# Altium project HIVE_BOARD.PrjPcb (part 6 of 6)

## Sheet HIVE_BOARD_DEBUG.SchDoc
size Tabloid; SheetNumber: 10; SheetTotal: 12; Size: 11x17; Sheet_Name: DEBUG
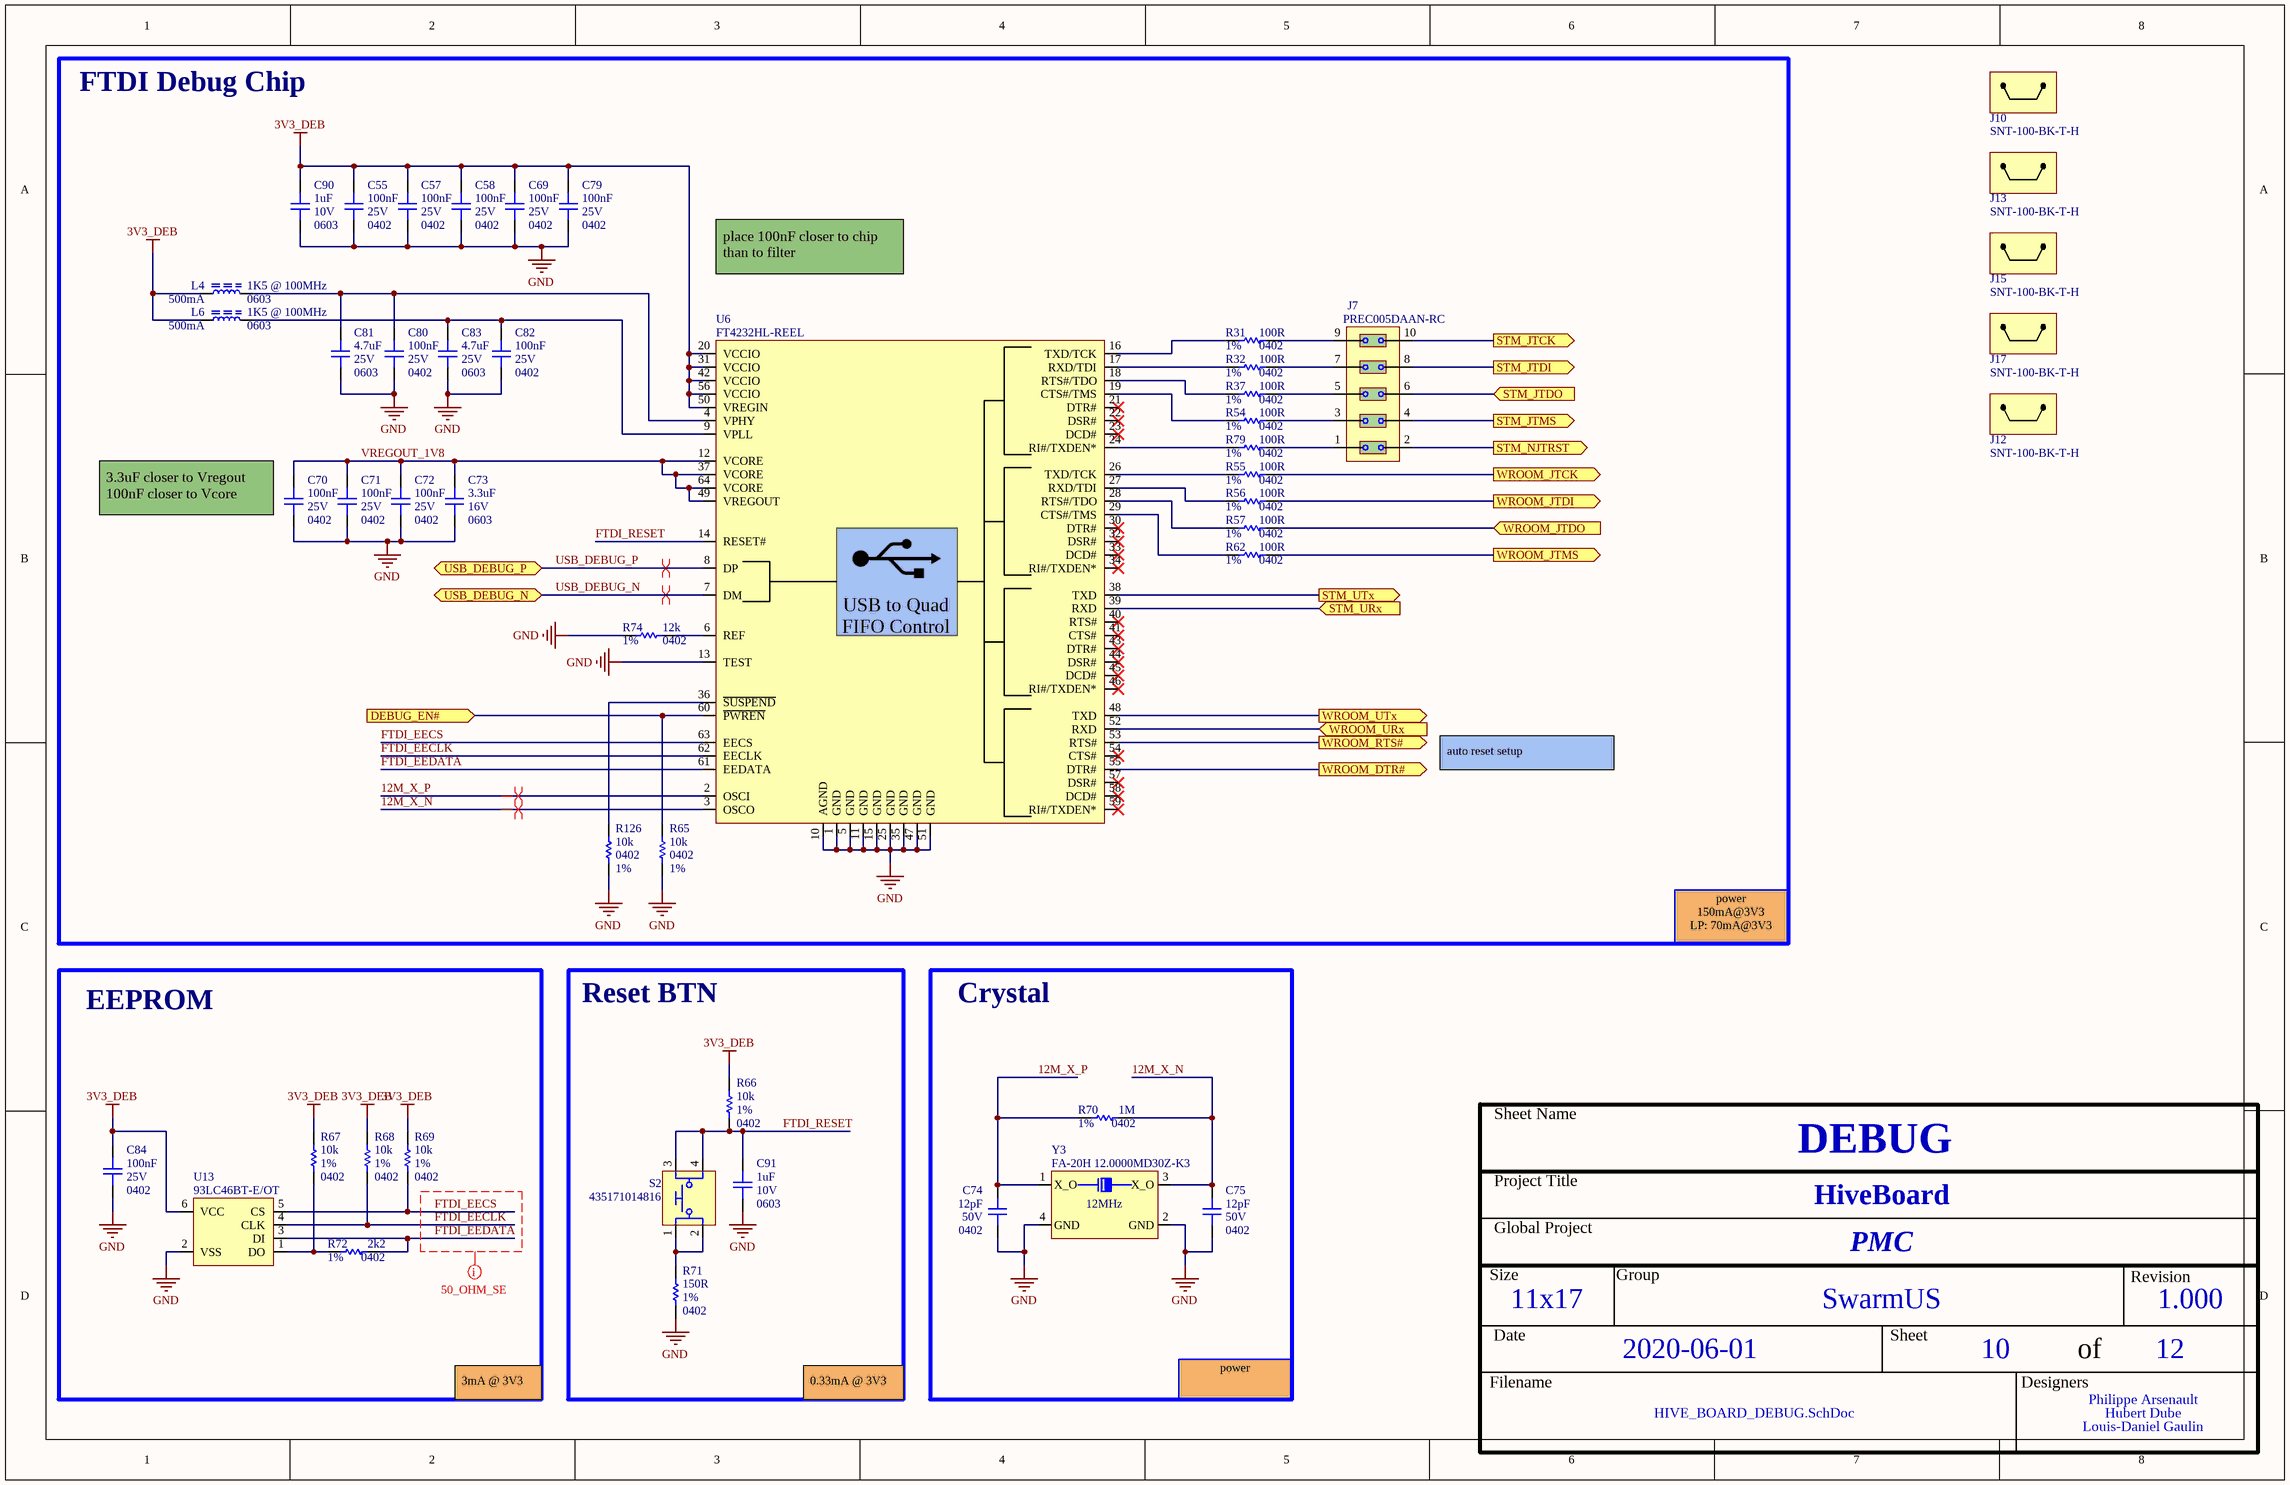
[diagram p11: HIVE_BOARD_DEBUG.SchDoc]

### Parts
C55  value 100nF  Package: 0402  Voltage Rating: 25V  [CAP_CER_0402]  (hidden comment: CGA2B3X7R1E104K050BB)
C57  value 100nF  Package: 0402  Voltage Rating: 25V  [CAP_CER_0402]  (hidden comment: CGA2B3X7R1E104K050BB)
C58  value 100nF  Package: 0402  Voltage Rating: 25V  [CAP_CER_0402]  (hidden comment: CGA2B3X7R1E104K050BB)
C69  value 100nF  Package: 0402  Voltage Rating: 25V  [CAP_CER_0402]  (hidden comment: CGA2B3X7R1E104K050BB)
C70  value 100nF  Package: 0402  Voltage Rating: 25V  [CAP_CER_0402]  (hidden comment: CGA2B3X7R1E104K050BB)
C71  value 100nF  Package: 0402  Voltage Rating: 25V  [CAP_CER_0402]  (hidden comment: CGA2B3X7R1E104K050BB)
C72  value 100nF  Package: 0402  Voltage Rating: 25V  [CAP_CER_0402]  (hidden comment: CGA2B3X7R1E104K050BB)
C73  value 3.3uF  Package: 0603  Voltage Rating: 16V  [CAP_CER_0603]  (hidden comment: C1608X5R1C335K080AC)
C74  value 12pF  Package: 0402  Voltage Rating: 50V  [CAP_CER_0402]  (hidden comment: CC0402JRNPO9BN120)
C75  value 12pF  Package: 0402  Voltage Rating: 50V  [CAP_CER_0402]  (hidden comment: CC0402JRNPO9BN120)
C79  value 100nF  Package: 0402  Voltage Rating: 25V  [CAP_CER_0402]  (hidden comment: CGA2B3X7R1E104K050BB)
C80  value 100nF  Package: 0402  Voltage Rating: 25V  [CAP_CER_0402]  (hidden comment: CGA2B3X7R1E104K050BB)
C81  value 4.7uF  Package: 0603  Voltage Rating: 25V  [CAP_CER_0603]  (hidden comment: CL10A475MA8NQNC)
C82  value 100nF  Package: 0402  Voltage Rating: 25V  [CAP_CER_0402]  (hidden comment: CGA2B3X7R1E104K050BB)
C83  value 4.7uF  Package: 0603  Voltage Rating: 25V  [CAP_CER_0603]  (hidden comment: CL10A475MA8NQNC)
C84  value 100nF  Package: 0402  Voltage Rating: 25V  [CAP_CER_0402]  (hidden comment: CGA2B3X7R1E104K050BB)
C90  value 1uF  Package: 0603  Voltage Rating: 10V  [CAP_CER_0603]  (hidden comment: C0603C105K8PACTU)
C91  value 1uF  Package: 0603  Voltage Rating: 10V  [CAP_CER_0603]  (hidden comment: C0603C105K8PACTU)
J7  PREC005DAAN-RC  [CON_HDR_PREC009DAAN-RC]
J10  SNT-100-BK-T-H  [CON_JMP_SNT-100-BK-T-H]
J12  SNT-100-BK-T-H  [CON_JMP_SNT-100-BK-T-H]
J13  SNT-100-BK-T-H  [CON_JMP_SNT-100-BK-T-H]
J15  SNT-100-BK-T-H  [CON_JMP_SNT-100-BK-T-H]
J17  SNT-100-BK-T-H  [CON_JMP_SNT-100-BK-T-H]
L4  value 1K5 @ 100MHz  Current Rating: 500mA  Package: 0603  [FER_0603]  (hidden comment: BLM18HE152SN1D)
L6  value 1K5 @ 100MHz  Current Rating: 500mA  Package: 0603  [FER_0603]  (hidden comment: BLM18HE152SN1D)
R31  value 100R  Tolerance: 1%  Package: 0402  [RES_0402]  (hidden comment: RC0402FR-07100RP)
R32  value 100R  Tolerance: 1%  Package: 0402  [RES_0402]  (hidden comment: RC0402FR-07100RP)
R37  value 100R  Tolerance: 1%  Package: 0402  [RES_0402]  (hidden comment: RC0402FR-07100RP)
R54  value 100R  Tolerance: 1%  Package: 0402  [RES_0402]  (hidden comment: RC0402FR-07100RP)
R55  value 100R  Tolerance: 1%  Package: 0402  [RES_0402]  (hidden comment: RC0402FR-07100RP)
R56  value 100R  Tolerance: 1%  Package: 0402  [RES_0402]  (hidden comment: RC0402FR-07100RP)
R57  value 100R  Tolerance: 1%  Package: 0402  [RES_0402]  (hidden comment: RC0402FR-07100RP)
R62  value 100R  Tolerance: 1%  Package: 0402  [RES_0402]  (hidden comment: RC0402FR-07100RP)
R65  value 10k  Tolerance: 1%  Package: 0402  [RES_0402]  (hidden comment: RC0402FR-0710KL)
R66  value 10k  Tolerance: 1%  Package: 0402  [RES_0402]  (hidden comment: RC0402FR-0710KL)
R67  value 10k  Tolerance: 1%  Package: 0402  [RES_0402]  (hidden comment: RC0402FR-0710KL)
R68  value 10k  Tolerance: 1%  Package: 0402  [RES_0402]  (hidden comment: RC0402FR-0710KL)
R69  value 10k  Tolerance: 1%  Package: 0402  [RES_0402]  (hidden comment: RC0402FR-0710KL)
R70  value 1M  Tolerance: 1%  Package: 0402  [RES_0402]  (hidden comment: RC0402FR-071ML)
R71  value 150R  Tolerance: 1%  Package: 0402  [RES_0402]  (hidden comment: RC0402FR-07150RL)
R72  value 2k2  Tolerance: 1%  Package: 0402  [RES_0402]  (hidden comment: RC0402FR-072K2L)
R74  value 12k  Tolerance: 1%  Package: 0402  [RES_0402]  (hidden comment: RC0402FR-0712KL)
R79  value 100R  Tolerance: 1%  Package: 0402  [RES_0402]  (hidden comment: RC0402FR-07100RP)
R126  value 10k  Tolerance: 1%  Package: 0402  [RES_0402]  (hidden comment: RC0402FR-0710KL)
S2  435171014816  [SWI_TACT_435171014816]
U6  FT4232HL-REEL  [COM_USB_FT4232HL-REEL]
U13  93LC46BT-E/OT  [MEM_EEPROM_93LC46BT-E/OT]
Y3  FA-20H 12.0000MD30Z-K3  [CRY_FA-20H]

### Blocks framed on the sheet
FTDI Debug Chip: C55 C57 C58 C69-C73 C79-C83 C90 J7 L4 L6 R31 R32 R37 R54-R57 R62 R65 R74 R79 R126 U6
EEPROM: C84 R67-R69 R72 U13
Reset BTN: C91 R66 R71 S2
Crystal: C74 C75 R70 Y3

### Ports
DEBUG_EN# (in), STM_JTCK (out), STM_JTDI (out), STM_JTDO (in), STM_JTMS (out), STM_NJTRST (out), STM_URx (in), STM_UTx (out), USB_DEBUG_N (bidir), USB_DEBUG_P (bidir), WROOM_DTR# (out), WROOM_JTCK (out), WROOM_JTDI (out), WROOM_JTDO (in), WROOM_JTMS (out), WROOM_RTS# (out), WROOM_URx (in), WROOM_UTx (out)

### Nets
3V3_DEB: C55.1 C57.1 C58.1 C69.1 C79.1 C84.1 C90.1 L4.1 L6.1 R66.2 R67.2 R68.2 R69.2 U6.20(VCCIO) U6.31(VCCIO) U6.42(VCCIO) U6.50(VREGIN) U6.56(VCCIO) U13.6(VCC)
GND: C55.2 C57.2 C58.2 C69.2 C70.2 C71.2 C72.2 C73.1 C74.1 C75.1 C79.2 C80.2 C81.1 C82.2 C83.1 C84.2 C90.2 C91.2 R65.2 R71.1 R74.1 R126.2 U6.1(GND) U6.5(GND) U6.10(AGND) U6.11(GND) U6.13(TEST) U6.15(GND) U6.25(GND) U6.35(GND) U6.47(GND) U6.51(GND) U13.2(VSS) Y3.2(GND) Y3.4(GND)
12M_X_N: C75.2 R70.1 U6.3(OSCO) Y3.3(X_O)
12M_X_P: C74.2 R70.2 U6.2(OSCI) Y3.1(X_O)
FTDI_EECLK: R68.1 U6.62(EECLK) U13.4(CLK)
FTDI_EECS: R69.1 U6.63(EECS) U13.5(CS)
FTDI_EEDATA: R72.1 U6.61(EEDATA) U13.3(DI)
FTDI_RESET: C91.1 R66.1 S2.3 S2.4 U6.14(RESET#)
USB_DEBUG_N: U6.7(DM) ; port USB_DEBUG_N
USB_DEBUG_P: U6.8(DP) ; port USB_DEBUG_P
VREGOUT_1V8: C70.1 C71.1 C72.1 C73.2 U6.12(VCORE) U6.37(VCORE) U6.49(VREGOUT) U6.64(VCORE)
NetC80_1: C80.1 C81.2 L4.2 U6.4(VPHY)
NetC82_1: C82.1 C83.2 L6.2 U6.9(VPLL)
NetJ7_1: J7.1 R79.1
NetJ7_2: J7.2 ; port STM_NJTRST
NetJ7_3: J7.3 R54.1
NetJ7_4: J7.4 ; port STM_JTMS
NetJ7_5: J7.5 R37.1
NetJ7_6: J7.6 ; port STM_JTDO
NetJ7_7: J7.7 R32.1
NetJ7_8: J7.8 ; port STM_JTDI
NetJ7_9: J7.9 R31.1
NetJ7_10: J7.10 ; port STM_JTCK
NetQ5_1: U6.55(DTR#) ; port WROOM_DTR#
NetQ5_2: U6.53(RTS#) ; port WROOM_RTS#
NetR31_2: R31.2 U6.16(TXD/TCK)
NetR32_2: R32.2 U6.17(RXD/TDI)
NetR37_2: R37.2 U6.18(RTS#/TDO)
NetR54_2: R54.2 U6.19(CTS#/TMS)
NetR55_1: R55.1 ; port WROOM_JTCK
NetR55_2: R55.2 U6.26(TXD/TCK)
NetR56_1: R56.1 ; port WROOM_JTDI
NetR56_2: R56.2 U6.27(RXD/TDI)
NetR57_1: R57.1 ; port WROOM_JTDO
NetR57_2: R57.2 U6.28(RTS#/TDO)
NetR62_1: R62.1 ; port WROOM_JTMS
NetR62_2: R62.2 U6.29(CTS#/TMS)
NetR65_1: R65.1 U6.60(~{PWREN}) ; port DEBUG_EN#
NetR67_1: R67.1 R72.2 U13.1(DO)
NetR71_2: R71.2 S2.1 S2.2
NetR74_2: R74.2 U6.6(REF)
NetR79_2: R79.2 U6.24(RI#/TXDEN*)
NetR126_1: R126.1 U6.36(~{SUSPEND})
NetU1_76: U6.39(RXD) ; port STM_URx
NetU1_77: U6.38(TXD) ; port STM_UTx
NetU5_34: U6.48(TXD) ; port WROOM_UTx
NetU5_35: U6.52(RXD) ; port WROOM_URx

Not connected (* = marked no-connect by the designer): U6 21(DTR#)* 22(DSR#)* 23(DCD#)* 30(DTR#)* 32(DSR#)* 33(DCD#)* 34(RI#/TXDEN*)* 40(RTS#)* 41(CTS#)* 43(DTR#)* 44(DSR#)* 45(DCD#)* 46(RI#/TXDEN*)* 54(CTS#)* 57(DSR#)* 58(DCD#)* 59(RI#/TXDEN*)*

### Layout directives
differential pair; net class DIFF_90: USB_DEBUG_N, USB_DEBUG_P
net class SE_50: FTDI_EECLK, FTDI_EECS, FTDI_EEDATA
differential pair; differential pair class DIFF_100: 12M_X_N, 12M_X_P

### Notes on the sheet
- place 100nF closer to chip than to filter
- (near C70) 3.3uF closer to Vregout
  100nF closer to Vcore
- auto reset setup
- power
  150mA@3V3
  LP: 70mA@3V3
- 3mA @ 3V3
- 0.33mA @ 3V3
- power
- Sheet Name
- Project Title
- Global Project
- Size
- Group
- Revision
- Date
- Sheet
- of
- Filename
- Designers
- (in symbol COM_USB_FT4232HL-REEL) / USB to Quad / FIFO Control

### Library data of the parts
C55 C57 C58 C69-C72 C79 C80 C82 C84 = CAP_CER_CGA2B3X7R1E104K050BB: CAP - CER 0.1µF 10% 25V X7R - 0402; Manufacturer #1: TDK Corporation; GRAMS Lib Spec: 2.8; Magnetic Material: Unknown; Polarized: NO; Assembly Type: SMD; CreatedBy/Date: Nicolas Roy 2018-11-07; Current Rating: *; HelpURL: https://product.tdk.com/info/en/catalog/datasheets/mlcc_automotive_general_en.pdf; Manufacturer #2: *; Note: *; Part Number #1: CGA2B3X7R1E104K050BB; Part Number #2: *; Power Max: *; Temperature: -55°C ~ 125°C; Tolerance: 10%; VerifiedBy: Nicolas V. (2019-01-22); Supplier 1: Digi-Key; Supplier Part Number 1: 445-6902-1-ND; Cryo: UNKNOWN
C73 = CAP_CER_C1608X5R1C335K080AC: CAP - CER 3.3µF ±10% 16V Ceramic Capacitor X5R 0603 (1608 Metric); Manufacturer #1: TDK Corporation; GRAMS Lib Spec: 2.8; Magnetic Material: Unknown; Polarized: No; Tolerance: 10%; Current Rating: *; Power Max: *; HelpURL: https://product.tdk.com/en/system/files?file=dam/doc/product/capacitor/ceramic/mlcc/catalog/mlcc_commercial_general_en.pdf; CreatedBy/Date: Hubert Dube - 16/03/2021; VerifiedBy: Philippe Arsenault - 2021/03/16; Temperature: -55°C ~ 85°C; Manufacturer #2: *; Note: *; Assembly Type: SMD; Part Number #2: *; Part Number #1: C1608X5R1C335K080AC; Cryo: UNKNOWN; Supplier 1: Digi-Key; Supplier Part Number 1: 445-7476-1-ND
C74 C75 = CAP_CER_CC0402JRNPO9BN120: CAP - CER 12pF 50V ±5% C0G, NP0 - 0402; Manufacturer #1: Yageo; GRAMS Lib Spec: 2.8; Magnetic Material: Unknown; Polarized: NO; Assembly Type: SMD; CreatedBy/Date: Philippe Arsenault/ 2020-07-24; Current Rating: *; HelpURL: https://www.yageo.com/upload/media/product/productsearch/datasheet/mlcc/UPY-GP_NP0_16V-to-50V_18.pdf; Manufacturer #2: *; Note: *; Part Number #1: CC0402JRNPO9BN120; Part Number #2: *; Power Max: *; Temperature: -55°C ~ 125°C; Tolerance: ±5%; VerifiedBy: Louis-Daniel Gaulin / 2020-07-29; Cryo: UNKNOWN; Supplier 1: Digi-Key; Supplier Part Number 1: 311-1016-1-ND
C81 C83 = CAP_CER_CL10A475MA8NQNC: CAP - CER 4.7µF 20% 25V X5R - 0603; Manufacturer #1: Samsung Electro-Mechanics; GRAMS Lib Spec: 2.8; Magnetic Material: Unknown; Polarized: NO; Assembly Type: SMD; CreatedBy/Date: Nicolas Roy 2018-11-21; Current Rating: *; HelpURL: http://www.samsungsem.com/kr/support/product-search/mlcc/__icsFiles/afieldfile/2018/06/20/CL10A475MA8NQNC.pdf; Manufacturer #2: *; Note: *; Part Number #1: CL10A475MA8NQNC; Part Number #2: *; Power Max: *; Temperature: -55°C ~ 85°C; Tolerance: 20%; VerifiedBy: Nicolas V. (2019-01-22); Supplier 1: Digi-Key; Supplier Part Number 1: 1276-1903-1-ND; Cryo: UNKNOWN
C90 C91 = CAP_CER_C0603C105K8PACTU: CAP - CER 1uF 10V 10% X5R - 0603; Manufacturer #1: KEMET; GRAMS Lib Spec: 2.8; Magnetic Material: Unknown; Polarized: NO; Tolerance: 10%; Current Rating: *; Power Max: *; HelpURL: https://content.kemet.com/datasheets/KEM_C1006_X5R_SMD.pdf; CreatedBy/Date: Hubert Dube - 21/07/20; VerifiedBy: Louis-Daniel Gaulin - 21/07/20; Temperature: -55°C ~ 85°C; Manufacturer #2: *; Assembly Type: SMD; Part Number #2: *; Part Number #1: C0603C105K8PACTU; Cryo: UNKNOWN; Supplier 1: Digi-Key; Supplier Part Number 1: 399-3118-1-ND
J7 = CON_HDR_PREC005DAAN-RC: CON - Connector Header Through Hole 10 position 0.100" (2.54mm); Manufacturer #1: Sullins Connector Solutions; Value: 5x2; Current Rating: 3A; GRAMS Lib Spec: 2.8; Magnetic Material: Unknown; Polarized: Yes; Tolerance: *; Voltage Rating: *; Power Max: *; HelpURL: https://drawings-pdf.s3.amazonaws.com/11636.pdf; VerifiedBy: Louis-Daniel Gaulin / 08-04-2021; Temperature: -40°C ~ 105°C; Package: TH 2x5; Manufacturer #2: *; Assembly Type: TH; Part Number #2: *; Part Number #1: PREC005DAAN-RC; CreatedBy/Date: Philippe Arsenault/2021-03-27; Supplier 1: Digi-Key; Supplier Part Number 1: S2012EC-05-ND
J10 J12 J13 J15 J17 = CON_JMP_SNT-100-BK-T-H: CON - CONN SHUNT - MEC; Manufacturer #1: Samtec Inc.; Voltage Rating: 450 VAC; Current Rating: 4.3A; GRAMS Lib Spec: 2.8; Magnetic Material: UNKNOWN; Polarized: NO; Value: *; Tolerance: *; Power Max: *; HelpURL: http://suddendocs.samtec.com/catalog_english/snt.pdf; CreatedBy/Date: Arnaud Samson - 09/07/18; VerifiedBy: Jonathan Bouchard 2018-07-12; Temperature: -55 °C to +125 °C; Package: MEC; Manufacturer #2: *; Note: *; Assembly Type: MANUAL; Part Number #2: *; Part Number #1: SNT-100-BK-T-H; Supplier 1: Digi-Key; Supplier Part Number 1: SAM8972-ND
L4 L6 = FER_BLM18HE152SN1D: FER - 1.5 kOhms @ 100MHz 1 Signal Line Ferrite Bead 0603 (1608 Metric) 500mA 500mOhm DC; Manufacturer #1: Murata Electronics; GRAMS Lib Spec: 2.8; Magnetic Material: Unknown; Polarized: No; Tolerance: *; Voltage Rating: *; Power Max: *; HelpURL: https://www.murata.com/en-us/products/productdata/8796741599262/ENFA0004.pdf; CreatedBy/Date: Hubert Dube - 16/03/2021; VerifiedBy: Philippe Arsenault - 2021-03-16; Temperature: -55°C ~ 125°C; Assembly Type: SMD; Part Number #2: *; Part Number #1: BLM18HE152SN1D; Cryo: UNKNOWN; Supplier 1: Digi-Key; Supplier Part Number 1: 490-5216-1-ND
R31 R32 R37 R54-R57 R62 R79 = RES_RC0402FR-07100RP: RES - 100R OHM 1% 1/16W - 0402; Manufacturer #1: Yageo; GRAMS Lib Spec: 2.8; Magnetic Material: YES; Polarized: NO; Voltage Rating: 50V; Cryo: UNKNOWN; Assembly Type: SMD; CreatedBy/Date: Jonathan Bouchard 2018-07-05; Current Rating: *; HelpURL: http://www.yageo.com/documents/recent/PYu-RC_Group_51_RoHS_L_9.pdf; Manufacturer #2: *; Note: *; Part Number #1: RC0402FR-07100RP; Part Number #2: *; Power Max: 1/16W; Temperature: -55°C ~ 155°C; VerifiedBy: Arnaud Samson 16-07-18; Supplier 1: Digi-Key; Supplier Part Number 1: YAG1248CT-ND
R65-R69 R126 = RES_RC0402FR-0710KL: RES - 10K OHMS 1% 1/16W - 0402; Manufacturer #1: Yageo; GRAMS Lib Spec: 2.8; Magnetic Material: UNKNOWN; Polarized: NO; Voltage Rating: 50V; Assembly Type: SMD; CreatedBy/Date: Nicolas V. (2018-11-20); Current Rating: *; HelpURL: http://www.yageo.com/documents/recent/PYu-RC_Group_51_RoHS_L_9.pdf; Manufacturer #2: *; Note: *; Part Number #1: RC0402FR-0710KL; Part Number #2: *; Power Max: 1/16W; Temperature: -55°C ~ 155°C; VerifiedBy: Nicolas V. (2018-11-20); Supplier 1: Digi-Key; Supplier Part Number 1: 311-10.0KLRCT-ND; Cryo: UNKNOWN
R70 = RES_RC0402FR-071ML: RES - 1 MOhms ±1% 0.063W, 1/16W Chip Resistor 0402 (1005 Metric) Moisture Resistant Thick Film; Manufacturer #1: Yageo; GRAMS Lib Spec: 2.8c; Magnetic Material: Unknown; Polarized: No; Voltage Rating: 50V; Assembly Type: SMD; CreatedBy/Date: Hubert Dube 16/03/2021; Current Rating: *; HelpURL: https://www.yageo.com/upload/media/product/productsearch/datasheet/rchip/PYu-RC_Group_51_RoHS_L_11.pdf; Manufacturer #2: *; Note: *; Part Number #1: RC0402FR-071ML; Part Number #2: *; Power Max: 1/16W; Temperature: -55°C ~ 155°C; VerifiedBy: Philippe Arsenault - 2021/03/16; Supplier 1: Digi-Key; Supplier Part Number 1: 311-1.00MLRCT-ND
R71 = RES_RC0402FR-07150RL: as R135-R150 on sheet HIVE_BOARD_MISC; Assembly Type: SMD; CreatedBy/Date: Jonathan Bouchard 2019-03-25; Current Rating: *; HelpURL: http://www.yageo.com/documents/recent/PYu-RC_Group_51_RoHS_L_10.pdf; Manufacturer #2: *; Part Number #1: RC0402FR-07150RL; Part Number #2: *; Power Max: 1/16W; Temperature: -55°C ~ 155°C; VerifiedBy: Nicolas V. (2019-05-02); Supplier 1: Digi-Key; Supplier Part Number 1: 311-150LRCT-ND; Cryo: UNKNOWN
R72 = RES_RC0402FR-072K2L: RES - 2.2K 1% 1/16W - 0402; Manufacturer #1: Yageo; GRAMS Lib Spec: 2.8; Magnetic Material: Unknown; Polarized: No; Voltage Rating: 50V; Assembly Type: SMD; CreatedBy/Date: Keven Deslandes 2018-11-14; Current Rating: *; HelpURL: http://www.yageo.com/documents/recent/PYu-RC_Group_51_RoHS_L_10.pdf; Manufacturer #2: *; Part Number #1: RC0402FR-072K2L; Part Number #2: *; Power Max: 1/16W; Temperature: -55°C ~ 155°C; VerifiedBy: Caroline Paulin - 8 janv 2019; Supplier 1: Digi-Key; Supplier Part Number 1: 311-2.20KLRCT-ND; Cryo: UNKNOWN
R74 = RES_RC0402FR-0712KL: RES - 12k Ohms ±1% 0.063W, 1/16W Chip Resistor 0402 (1005 Metric) Moisture Resistant Thick Film; Manufacturer #1: Yageo; GRAMS Lib Spec: 2.8c; Magnetic Material: Unknown; Polarized: No; Voltage Rating: 50V; Assembly Type: SMD; CreatedBy/Date: Philippe Arsenault/2021-03-11; Current Rating: *; HelpURL: https://www.yageo.com/upload/media/product/productsearch/datasheet/rchip/PYu-RC_Group_51_RoHS_L_11.pdf; Manufacturer #2: *; Note: *; Part Number #1: RC0402FR-0712KL; Part Number #2: *; Power Max: 1/16W; Temperature: -55°C ~ 155°C; VerifiedBy: Hubert Dube - 19/03/2021; Supplier 1: Digi-Key; Supplier Part Number 1: 311-12.0KLRCT-ND
S2 = SWI_TACT_435171014816: SWI - SWITCH TACTILE SPST-NO 0.05A 12V -SMD; Manufacturer #1: Würth Elektronik; Current Rating: 50mA; Voltage rating: 12VDC; Polarized: No; Magnetic Material: UNKNOWN; GRAMS Lib Spec: 2.8; Manufacturer #2: *; Power Max: *; Value: SPST-NO; Part Number #1: 435171014816; Part Number #2: *; HelpURL: https://www.we-online.com/catalog/datasheet/435171014816.pdf; Supplier 1: Digi-Key; Supplier Part Number 1: 732-435171014816CT-ND; Assembly Type: SMD; Temperature: -40°C ~ 85°C; Package: SMD; CreatedBy/Date: Hubert Dube - 22/07/20; Tolerance: *; VerifiedBy: Louis-Daniel Gaulin / 12-11-2020; Cryo: UNKNOWN
U6 = COM_USB_FT4232HL-REEL: COM_USB - Bridge, USB to UART,FIFO USB 2.0 FIFO, JTAG Quad channel Interface -  64-LQFP (10x10); Manufacturer #1: FTDI, Future Technology Devices International Ltd; Voltage Rating: 3V ~ 3.6V (VCCIO), 1.62V ~ 1.98V (core); Current Rating: 220mA; Power Max: 800mW; GRAMS Lib Spec: 2.8; Magnetic Material: Unknown; Polarized: Yes; Value: *; Tolerance: *; HelpURL: https://www.ftdichip.com/Support/Documents/DataSheets/ICs/DS_FT4232H.pdf; VerifiedBy: Louis-Daniel Gaulin / 08-04-2021; Temperature: -40°C ~ 85°C; Package: 64-LQFP; Manufacturer #2: *; Assembly Type: SMD; Part Number #2: *; Part Number #1: FT4232HL-REEL; CreatedBy/Date: Philippe Arsenault/2021-04-07; Supplier 1: Digi-Key; Supplier Part Number 1: 768-1026-1-ND
U13 = MEM_EEPROM_93LC46BT-E/OT: EEPROM Memory IC 1Kb (128 x 8) SPI 2MHz  SOT-23-6; Manufacturer #1: Microchip Technology; Voltage Rating: 2.5V ~ 5.5V; GRAMS Lib Spec: 2.7; Magnetic Material: Unknown; Polarized: Yes; Value: 1Kb; Tolerance: *; Current Rating: *; Power Max: *; HelpURL: https://ww1.microchip.com/downloads/en/DeviceDoc/20001749K.pdf; VerifiedBy: Philippe Arsenault - 17/03/2021 + HD 19/03/2021; Temperature: -40°C ~ 125°C; Package: SOT-23-6; Manufacturer #2: *; Assembly Type: SMD; Part Number #2: *; Part Number #1: 93LC46BT-E/OT; CreatedBy/Date: Hubert Dube -  13/03/2021; Supplier 1: Digi-Key; Supplier Part Number 1: 93LC46BT-E/OTCT-ND
Y3 = CRY_FA-20H 12.0000MD30Z-K3: CRY - 12MHz ±30ppm Crystal 10pF 150 Ohms 4-SMD, No Lead; Manufacturer #1: EPSON; Voltage Rating: 1.8V ~ 3.3V; GRAMS Lib Spec: 2.8; Magnetic Material: Unknown; Polarized: Yes; Value: 12MHz; Tolerance: ±30ppm; Current Rating: *; Power Max: *; HelpURL: https://support.epson.biz/td/api/doc_check.php?dl=brief_FA-20H&lang=en; CreatedBy/Date: Hubert Dube - 13/03/2021; VerifiedBy: Philippe Arsenault - 2021/03/16; Temperature: -40°C ~ 85°C; Package: 4-SMD, No Lead; Manufacturer #2: *; Note: *; Assembly Type: SMD; Part Number #2: *; Part Number #1: FA-20H 12.0000MD30Z-K3; Cryo: UNKNOWN; Supplier 1: Digi-Key; Supplier Part Number 1: SER4113CT-ND

## Sheet HIVE_BOARD_BLOCK_DIAG.SchDoc
size Tabloid; SheetNumber: 2; SheetTotal: 12; Sheet_Name: Block diagram; Size: 11x17
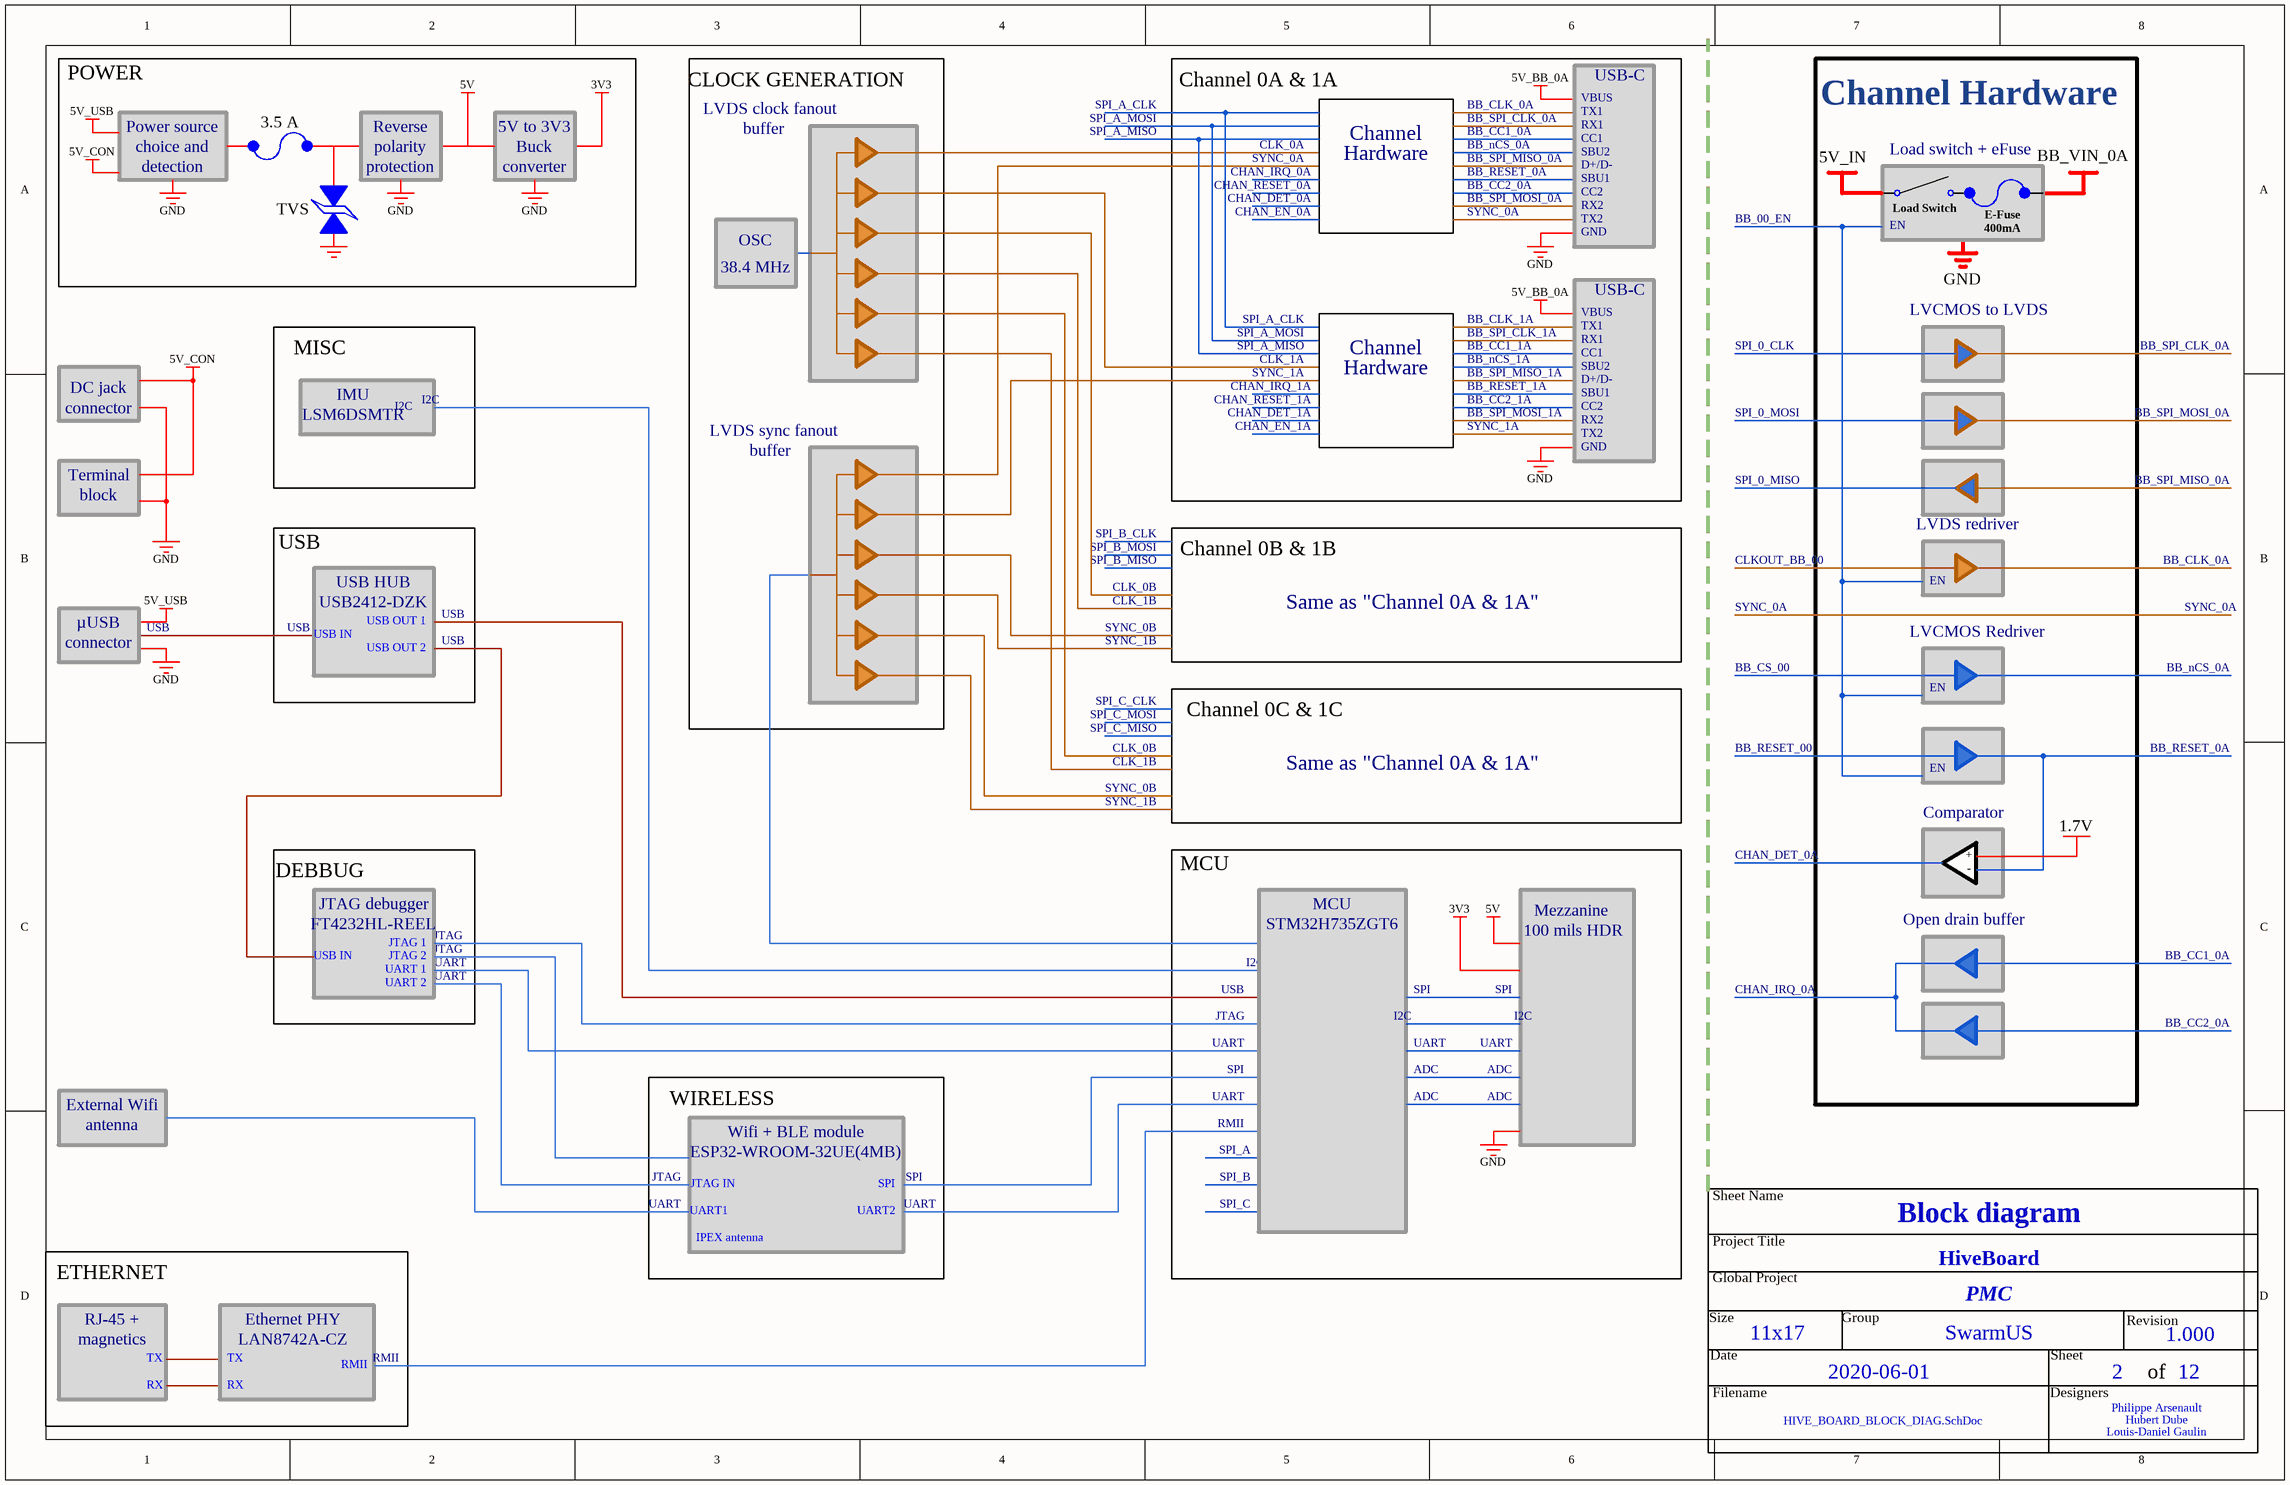
[diagram p12: HIVE_BOARD_BLOCK_DIAG.SchDoc]

### Notes on the sheet
- POWER
- 5V
- 3V3
- CLOCK GENERATION
- Channel 0A & 1A
- 5V_BB_0A
- USB-C
- Channel Hardware
- 5V_USB
- 5V_CON
- Power source
- choice and
- detection
- 3.5 A
- Reverse
- polarity
- protection
- 5V to 3V3
- Buck
- converter
- LVDS clock fanout
- buffer
- SPI_A_CLK
- SPI_A_MOSI
- SPI_A_MISO
- CLK_0A
- SYNC_0A
- Channel
- Hardware
- BB_SPI_MISO_0A
- BB_CLK_0A
- BB_SPI_CLK_0A
- BB_nCS_0A
- BB_CC1_0A
- TX1
- RX1
- CC1
- SBU2
- VBUS
- D+/D-
- 5V_IN
- Load switch + eFuse
- BB_VIN_0A
- GND
- TVS
- CHAN_IRQ_0A
- CHAN_RESET_0A
- CHAN_DET_0A
- CHAN_EN_0A
- BB_SPI_MOSI_0A
- BB_RESET_0A
- BB_CC2_0A
- SBU1
- CC2
- RX2
- TX2
- BB_00_EN
- Load Switch
- EN
- OSC
- 38.4 MHz
- E-Fuse
  400mA
- MISC
- CLK_1A
- BB_CLK_1A
- BB_SPI_CLK_1A
- BB_nCS_1A
- BB_CC1_1A
- SPI_0_CLK
- LVCMOS to LVDS
- DC jack
- connector
- IMU
- LSM6DSMTR
- I2C
- LVDS sync fanout
- SYNC_1A
- CHAN_IRQ_1A
- CHAN_RESET_1A
- CHAN_DET_1A
- CHAN_EN_1A
- BB_SPI_MISO_1A
- BB_SPI_MOSI_1A
- BB_RESET_1A
- BB_CC2_1A
- SPI_0_MOSI
- Terminal
- block
- SPI_0_MISO
- USB
- SPI_B_CLK
- SPI_B_MOSI
- SPI_B_MISO
- Channel 0B & 1B
- CLKOUT_BB_00
- LVDS redriver
- µUSB
- USB HUB
- USB2412-DZK
- USB OUT 1
- CLK_0B
- SYNC_0B
- CLK_1B
- Same as "Channel 0A & 1A"
- USB IN
- USB OUT 2
- SPI_C_CLK
- SYNC_1B
- Channel 0C & 1C
- BB_CS_00
- LVCMOS Redriver
- SPI_C_MOSI
- SPI_C_MISO
- BB_RESET_00
- Comparator
- 1.7V
- DEBBUG
- JTAG debugger
- MCU
- +
- -
- FT4232HL-REEL
- JTAG 1
- JTAG 2
- UART 1
- JTAG
- UART
- STM32H735ZGT6
- Mezzanine
- 100 mils HDR
- Open drain buffer
- UART 2
- SPI
- External Wifi
- WIRELESS
- ADC
- antenna
- Wifi + BLE module
- ESP32-WROOM-32UE(4MB)
- RMII
- SPI_A
- IPEX antenna
- UART1
- JTAG IN
- UART2
- SPI_B
- SPI_C
- ETHERNET
- RJ-45 +
- magnetics
- TX
- Ethernet PHY
- LAN8742A-CZ
- RX
- Sheet Name
- Project Title
- Global Project
- Revision
- Size
- Date
- Group
- Sheet
- of
- Filename
- Designers

## Nets that join several sheets
3V3: HIVE_BOARD_MCU (45 pins), HIVE_BOARD_POWER (24 pins), TOP/CHAN 0A + 1A (15 pins), HIVE_BOARD_MISC (18 pins), HIVE_BOARD_USB (20 pins), TOP/CHAN 0B + 1B (15 pins), TOP/CHAN 0C + 1C (15 pins)
3V3_CH: HIVE_BOARD_POWER (C112.1 TP17.1 U12.1), TOP/CHAN 0A + 1A (37 pins), TOP/CHAN 0B + 1B (37 pins), TOP/CHAN 0C + 1C (37 pins)
3V3_CL: HIVE_BOARD_POWER (C116.1 TP11.1 U14.1), HIVE_BOARD_CLOCK_GEN (32 pins)
3V3_DEB: HIVE_BOARD_POWER (C137.1 TP20.1 U30.1), HIVE_BOARD_DEBUG (19 pins)
3V3_ETH: HIVE_BOARD_POWER (C134.1 TP19.1 U24.1), HIVE_BOARD_ETHERNET (13 pins)
3V3_WR: HIVE_BOARD_POWER (C138.1 TP18.1 U26.1), HIVE_BOARD_WIRELESS (7 pins)
5V: HIVE_BOARD_MCU (D27.1 J8.2), HIVE_BOARD_POWER (11 pins), TOP/CHAN 0A + 1A (11 pins), TOP/CHAN 0B + 1B (11 pins), TOP/CHAN 0C + 1C (11 pins)
5V_CONN: HIVE_BOARD_TOP (J2.1 J3.2), HIVE_BOARD_POWER (S4.3 S4.6 TP3.1)
5V_USB: HIVE_BOARD_TOP (J1.1), HIVE_BOARD_POWER (S4.1 TP1.1), HIVE_BOARD_USB (R7.1)
GND: HIVE_BOARD_TOP (8 pins), HIVE_BOARD_MCU (69 pins), HIVE_BOARD_POWER (44 pins), HIVE_BOARD_CLOCK_GEN (32 pins), TOP/CHAN 0A + 1A (82 pins), HIVE_BOARD_MISC (17 pins), HIVE_BOARD_ETHERNET (29 pins), HIVE_BOARD_WIRELESS (13 pins), HIVE_BOARD_USB (18 pins), HIVE_BOARD_DEBUG (35 pins), TOP/CHAN 0B + 1B (82 pins), TOP/CHAN 0C + 1C (82 pins)
CH_CL_PWR_EN: HIVE_BOARD_MCU (U1.86), HIVE_BOARD_POWER (5 pins)
CHAN_DET_0A: HIVE_BOARD_MCU (U1.120), TOP/CHAN 0A + 1A (R113A.2 U16A.13)
CHAN_DET_0B: HIVE_BOARD_MCU (U1.94), TOP/CHAN 0B + 1B (R113B.2 U16B.13)
CHAN_DET_0C: HIVE_BOARD_MCU (U1.60), TOP/CHAN 0C + 1C (R113C.2 U16C.13)
CHAN_DET_1A: HIVE_BOARD_MCU (U1.117), TOP/CHAN 0A + 1A (R124A.2 U16A.16)
CHAN_DET_1B: HIVE_BOARD_MCU (U1.93), TOP/CHAN 0B + 1B (R124B.2 U16B.16)
CHAN_DET_1C: HIVE_BOARD_MCU (U1.59), TOP/CHAN 0C + 1C (R124C.2 U16C.16)
CHAN_EN_0A: HIVE_BOARD_MCU (U1.125), TOP/CHAN 0A + 1A (U23A.6)
CHAN_EN_0B: HIVE_BOARD_MCU (U1.97), TOP/CHAN 0B + 1B (U23B.6)
CHAN_EN_0C: HIVE_BOARD_MCU (U1.61), TOP/CHAN 0C + 1C (U23C.6)
CHAN_EN_1A: HIVE_BOARD_MCU (U1.114), TOP/CHAN 0A + 1A (U25A.6)
CHAN_EN_1B: HIVE_BOARD_MCU (U1.84), TOP/CHAN 0B + 1B (U25B.6)
CHAN_EN_1C: HIVE_BOARD_MCU (U1.52), TOP/CHAN 0C + 1C (U25C.6)
CHAN_IRQ_0A: HIVE_BOARD_MCU (U1.123), TOP/CHAN 0A + 1A (R93A.2 U11A.4 U11A.6)
CHAN_IRQ_0B: HIVE_BOARD_MCU (U1.95), TOP/CHAN 0B + 1B (R93B.2 U11B.4 U11B.6)
CHAN_IRQ_0C: HIVE_BOARD_MCU (U1.65), TOP/CHAN 0C + 1C (R93C.2 U11C.4 U11C.6)
CHAN_IRQ_1A: HIVE_BOARD_MCU (U1.115), TOP/CHAN 0A + 1A (R112A.2 U20A.4 U20A.6)
CHAN_IRQ_1B: HIVE_BOARD_MCU (U1.82), TOP/CHAN 0B + 1B (R112B.2 U20B.4 U20B.6)
CHAN_IRQ_1C: HIVE_BOARD_MCU (U1.45), TOP/CHAN 0C + 1C (R112C.2 U20C.4 U20C.6)
CHAN_RESET_0A: HIVE_BOARD_MCU (U1.113), TOP/CHAN 0A + 1A (U18A.5)
CHAN_RESET_0B: HIVE_BOARD_MCU (U1.83), TOP/CHAN 0B + 1B (U18B.5)
CHAN_RESET_0C: HIVE_BOARD_MCU (U1.44), TOP/CHAN 0C + 1C (U18C.5)
CHAN_RESET_1A: HIVE_BOARD_MCU (U1.112), TOP/CHAN 0A + 1A (U18A.12)
CHAN_RESET_1B: HIVE_BOARD_MCU (U1.81), TOP/CHAN 0B + 1B (U18B.12)
CHAN_RESET_1C: HIVE_BOARD_MCU (U1.43), TOP/CHAN 0C + 1C (U18C.12)
CLK_0A_N: HIVE_BOARD_CLOCK_GEN (U7.4), TOP/CHAN 0A + 1A (R94A.1 U10A.2)
CLK_0A_P: HIVE_BOARD_CLOCK_GEN (U7.5), TOP/CHAN 0A + 1A (R94A.2 U10A.3)
CLK_0B_N: HIVE_BOARD_CLOCK_GEN (U7.2), TOP/CHAN 0B + 1B (R94B.1 U10B.2)
CLK_0B_P: HIVE_BOARD_CLOCK_GEN (U7.3), TOP/CHAN 0B + 1B (R94B.2 U10B.3)
CLK_0C_N: HIVE_BOARD_CLOCK_GEN (U7.22), TOP/CHAN 0C + 1C (R94C.1 U10C.2)
CLK_0C_P: HIVE_BOARD_CLOCK_GEN (U7.23), TOP/CHAN 0C + 1C (R94C.2 U10C.3)
CLK_1A_N: HIVE_BOARD_CLOCK_GEN (U7.20), TOP/CHAN 0A + 1A (R128A.1 U22A.2)
CLK_1A_P: HIVE_BOARD_CLOCK_GEN (U7.21), TOP/CHAN 0A + 1A (R128A.2 U22A.3)
CLK_1B_N: HIVE_BOARD_CLOCK_GEN (U7.16), TOP/CHAN 0B + 1B (R128B.1 U22B.2)
CLK_1B_P: HIVE_BOARD_CLOCK_GEN (U7.17), TOP/CHAN 0B + 1B (R128B.2 U22B.3)
CLK_1C_N: HIVE_BOARD_CLOCK_GEN (U7.14), TOP/CHAN 0C + 1C (R128C.1 U22C.2)
CLK_1C_P: HIVE_BOARD_CLOCK_GEN (U7.15), TOP/CHAN 0C + 1C (R128C.2 U22C.3)
CLK_OE_0#: HIVE_BOARD_MCU (U1.88), HIVE_BOARD_CLOCK_GEN (U7.1 U8.1)
CLK_OE_1#: HIVE_BOARD_MCU (U1.87), HIVE_BOARD_CLOCK_GEN (U7.18 U8.18)
DEB_PWR_EN: HIVE_BOARD_MCU (U1.132), HIVE_BOARD_POWER (R125.2 S5.3 U30.3)
ETH_PWR_EN: HIVE_BOARD_MCU (U1.40), HIVE_BOARD_POWER (R109.2 S6.4 U24.3)
I2C_MISC_SCL: HIVE_BOARD_MCU (U1.133), HIVE_BOARD_MISC (R27.2 U3.13 U33.19)
I2C_MISC_SDA: HIVE_BOARD_MCU (U1.134), HIVE_BOARD_MISC (R28.2 U3.14 U33.20)
IMU_INT1: HIVE_BOARD_MCU (U1.9), HIVE_BOARD_MISC (U3.4)
IMU_INT2: HIVE_BOARD_MCU (U1.3), HIVE_BOARD_MISC (U3.9)
IO_EXP_INT#: HIVE_BOARD_MCU (U1.4), HIVE_BOARD_MISC (R134.1 U33.22)
NetJ7_2: HIVE_BOARD_MCU (U1.131), HIVE_BOARD_DEBUG (J7.2)
NetJ7_4: HIVE_BOARD_MCU (U1.102), HIVE_BOARD_DEBUG (J7.4)
NetJ7_6: HIVE_BOARD_MCU (U1.130), HIVE_BOARD_DEBUG (J7.6)
NetJ7_8: HIVE_BOARD_MCU (U1.108), HIVE_BOARD_DEBUG (J7.8)
NetJ7_10: HIVE_BOARD_MCU (U1.107), HIVE_BOARD_DEBUG (J7.10)
NetQ5_1: HIVE_BOARD_WIRELESS (Q5.1 Q6.2), HIVE_BOARD_DEBUG (U6.55)
NetQ5_2: HIVE_BOARD_WIRELESS (Q5.2 Q6.1), HIVE_BOARD_DEBUG (U6.53)
NetR16_2: HIVE_BOARD_MCU (U1.98), HIVE_BOARD_USB (R16.2 R17.1)
NetR18_2: HIVE_BOARD_MCU (U1.47), HIVE_BOARD_ETHERNET (R18.2)
NetR19_2: HIVE_BOARD_MCU (U1.48), HIVE_BOARD_ETHERNET (R19.2)
NetR38_2: HIVE_BOARD_MCU (U1.2), HIVE_BOARD_WIRELESS (R38.2)
NetR45_1: HIVE_BOARD_MCU (U1.39), HIVE_BOARD_ETHERNET (R45.1 U4.12)
NetR47_2: HIVE_BOARD_MCU (U1.46), HIVE_BOARD_ETHERNET (R47.2)
NetR48_2: HIVE_BOARD_MCU (U1.38), HIVE_BOARD_ETHERNET (R48.2)
NetR55_1: HIVE_BOARD_WIRELESS (U5.16), HIVE_BOARD_DEBUG (R55.1)
NetR56_1: HIVE_BOARD_WIRELESS (R59.2 U5.14), HIVE_BOARD_DEBUG (R56.1)
NetR57_1: HIVE_BOARD_WIRELESS (U5.23), HIVE_BOARD_DEBUG (R57.1)
NetR62_1: HIVE_BOARD_WIRELESS (U5.13), HIVE_BOARD_DEBUG (R62.1)
NetR65_1: HIVE_BOARD_MCU (U1.127), HIVE_BOARD_DEBUG (R65.1 U6.60)
NetR165_1: HIVE_BOARD_MCU (R165.1), HIVE_BOARD_ETHERNET (U4.17)
NetR167_1: HIVE_BOARD_MCU (R167.1), HIVE_BOARD_ETHERNET (U4.18)
NetR169_1: HIVE_BOARD_MCU (R169.1), HIVE_BOARD_WIRELESS (U5.30)
NetR170_1: HIVE_BOARD_MCU (R170.1), HIVE_BOARD_WIRELESS (U5.37)
NetR179_2: HIVE_BOARD_MCU (U1.99), HIVE_BOARD_CLOCK_GEN (R179.2)
NetU1_1: HIVE_BOARD_MCU (U1.1), HIVE_BOARD_WIRELESS (U5.10)
NetU1_22: HIVE_BOARD_MCU (U1.22), HIVE_BOARD_WIRELESS (U5.31)
NetU1_29: HIVE_BOARD_MCU (U1.29), HIVE_BOARD_ETHERNET (U4.13)
NetU1_67: HIVE_BOARD_MCU (U1.67), HIVE_BOARD_ETHERNET (U4.16)
NetU1_76: HIVE_BOARD_MCU (U1.76), HIVE_BOARD_DEBUG (U6.39)
NetU1_77: HIVE_BOARD_MCU (U1.77), HIVE_BOARD_DEBUG (U6.38)
NetU1_136: HIVE_BOARD_MCU (U1.136), HIVE_BOARD_WIRELESS (U5.29)
NetU1_138: HIVE_BOARD_MCU (U1.138), HIVE_BOARD_WIRELESS (U5.28)
NetU1_139: HIVE_BOARD_MCU (U1.139), HIVE_BOARD_WIRELESS (U5.27)
NetU5_34: HIVE_BOARD_WIRELESS (U5.34), HIVE_BOARD_DEBUG (U6.48)
NetU5_35: HIVE_BOARD_WIRELESS (U5.35), HIVE_BOARD_DEBUG (U6.52)
PHY_nRST: HIVE_BOARD_MCU (U1.37), HIVE_BOARD_ETHERNET (U4.15)
SPI_CLK_A: HIVE_BOARD_MCU (R171.2), TOP/CHAN 0A + 1A (U15A.2 U19A.2)
SPI_CLK_B: HIVE_BOARD_MCU (R163.2), TOP/CHAN 0B + 1B (U15B.2 U19B.2)
SPI_CLK_C: HIVE_BOARD_MCU (R162.1), TOP/CHAN 0C + 1C (U15C.2 U19C.2)
SPI_MISO_A: HIVE_BOARD_MCU (U1.122), TOP/CHAN 0A + 1A (R164A.2 R174A.2)
SPI_MISO_B: HIVE_BOARD_MCU (U1.110), TOP/CHAN 0B + 1B (R164B.2 R174B.2)
SPI_MISO_C: HIVE_BOARD_MCU (U1.74), TOP/CHAN 0C + 1C (R164C.2 R174C.2)
SPI_MOSI_A: HIVE_BOARD_MCU (R161.1), TOP/CHAN 0A + 1A (U15A.3 U19A.3)
SPI_MOSI_B: HIVE_BOARD_MCU (R166.2), TOP/CHAN 0B + 1B (U15B.3 U19B.3)
SPI_MOSI_C: HIVE_BOARD_MCU (R168.1), TOP/CHAN 0C + 1C (U15C.3 U19C.3)
SPI_nCS_0A: HIVE_BOARD_MCU (U1.126), TOP/CHAN 0A + 1A (U18A.2 U36A.2)
SPI_nCS_0B: HIVE_BOARD_MCU (U1.96), TOP/CHAN 0B + 1B (U18B.2 U36B.2)
SPI_nCS_0C: HIVE_BOARD_MCU (U1.51), TOP/CHAN 0C + 1C (U18C.2 U36C.2)
SPI_nCS_1A: HIVE_BOARD_MCU (U1.116), TOP/CHAN 0A + 1A (U18A.9 U37A.2)
SPI_nCS_1B: HIVE_BOARD_MCU (U1.85), TOP/CHAN 0B + 1B (U18B.9 U37B.2)
SPI_nCS_1C: HIVE_BOARD_MCU (U1.78), TOP/CHAN 0C + 1C (U18C.9 U37C.2)
SYNC_0A_N: HIVE_BOARD_CLOCK_GEN (U8.4), TOP/CHAN 0A + 1A (D10A.5 D10A.6 J4A.B3)
SYNC_0A_P: HIVE_BOARD_CLOCK_GEN (U8.5), TOP/CHAN 0A + 1A (D10A.4 D10A.7 J4A.B2)
SYNC_0B_N: HIVE_BOARD_CLOCK_GEN (U8.2), TOP/CHAN 0B + 1B (D10B.5 D10B.6 J4B.B3)
SYNC_0B_P: HIVE_BOARD_CLOCK_GEN (U8.3), TOP/CHAN 0B + 1B (D10B.4 D10B.7 J4B.B2)
SYNC_0C_N: HIVE_BOARD_CLOCK_GEN (U8.22), TOP/CHAN 0C + 1C (D10C.5 D10C.6 J4C.B3)
SYNC_0C_P: HIVE_BOARD_CLOCK_GEN (U8.23), TOP/CHAN 0C + 1C (D10C.4 D10C.7 J4C.B2)
SYNC_1A_N: HIVE_BOARD_CLOCK_GEN (U8.20), TOP/CHAN 0A + 1A (D18A.5 D18A.6 J5A.B3)
SYNC_1A_P: HIVE_BOARD_CLOCK_GEN (U8.21), TOP/CHAN 0A + 1A (D18A.4 D18A.7 J5A.B2)
SYNC_1B_N: HIVE_BOARD_CLOCK_GEN (U8.16), TOP/CHAN 0B + 1B (D18B.5 D18B.6 J5B.B3)
SYNC_1B_P: HIVE_BOARD_CLOCK_GEN (U8.17), TOP/CHAN 0B + 1B (D18B.4 D18B.7 J5B.B2)
SYNC_1C_N: HIVE_BOARD_CLOCK_GEN (U8.14), TOP/CHAN 0C + 1C (D18C.5 D18C.6 J5C.B3)
SYNC_1C_P: HIVE_BOARD_CLOCK_GEN (U8.15), TOP/CHAN 0C + 1C (D18C.4 D18C.7 J5C.B2)
USB_D_N: HIVE_BOARD_TOP (D7.5 D7.6 J1.2), HIVE_BOARD_USB (TP8.1 U9.21)
USB_D_P: HIVE_BOARD_TOP (D7.4 D7.7 J1.3), HIVE_BOARD_USB (TP8.2 U9.22)
USB_DEBUG_N: HIVE_BOARD_USB (TP9.2 U9.2), HIVE_BOARD_DEBUG (U6.7)
USB_DEBUG_P: HIVE_BOARD_USB (TP9.1 U9.3), HIVE_BOARD_DEBUG (U6.8)
USB_PWR_DET#: HIVE_BOARD_MCU (U1.5), HIVE_BOARD_POWER (7 pins)
USB_STM_D_N: HIVE_BOARD_MCU (U1.100), HIVE_BOARD_USB (TP10.2 U9.28)
USB_STM_D_P: HIVE_BOARD_MCU (U1.101), HIVE_BOARD_USB (TP10.1 U9.1)
WR_PWR_EN: HIVE_BOARD_MCU (U1.137), HIVE_BOARD_POWER (R120.2 S5.4 U26.3)